# Altium schematic sheet Leaf_Adapter.SchDoc
size A4
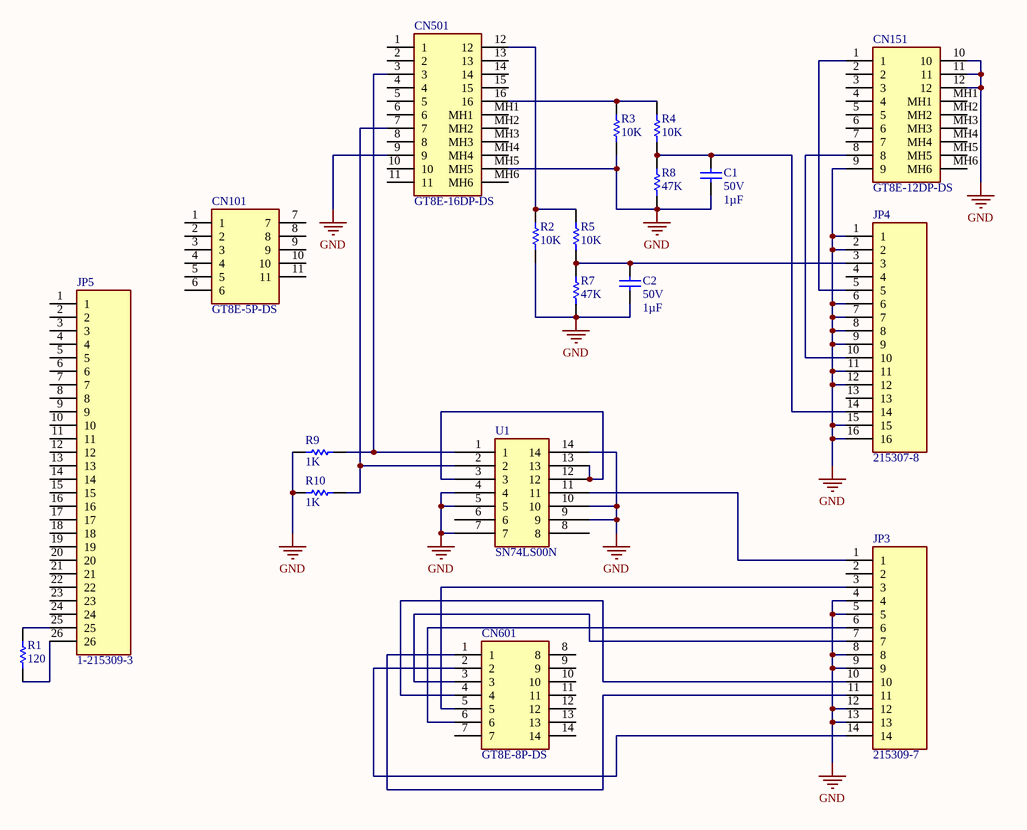
[diagram p0: Leaf_Adapter.SchDoc]

## Parts
C1  Voltage - Rated: 50V  Capacitance: 1µF  [KEMT-C330C105M5U5TA]  (hidden comment: C330C105M5U5TA)
C2  Voltage - Rated: 50V  Capacitance: 1µF  [KEMT-C330C105M5U5TA]  (hidden comment: C330C105M5U5TA)
CN101  GT8E-5P-DS  [GT8E5PDS]
CN151  GT8E-12DP-DS  [GT8E12DPDS]
CN501  GT8E-16DP-DS  [GT8E16DPDS]
CN601  GT8E-8P-DS  [GT8E8PDS]
JP3  215309-7  [TE_215309-7]
JP4  215307-8  [TE_215307-8]
JP5  1-215309-3  [TE_1-215309-3]
R1  Resistance: 120  [RESA60-630X240]  (hidden comment: MRS25000C1200FC100)
R2  Resistance: 10K  [RESA60-630X240]  (hidden comment: MFR-25FBF5210K)
R3  Resistance: 10K  [RESA60-630X240]  (hidden comment: MFR-25FBF5210K)
R4  Resistance: 10K  [RESA60-630X240]  (hidden comment: MFR-25FBF5210K)
R5  Resistance: 10K  [RESA60-630X240]  (hidden comment: MFR-25FBF5210K)
R7  Resistance: 47K  [RESA60-630X240]  (hidden comment: MRS25000C4702FC100)
R8  Resistance: 47K  [RESA60-630X240]  (hidden comment: MRS25000C4702FC100)
R9  Resistance: 1K  [RESA60-630X240]  (hidden comment: MFR-25FBF52-1K)
R10  Resistance: 1K  [RESA60-630X240]  (hidden comment: MFR-25FBF52-1K)
U1  SN74LS00N  [N0014A]

## Nets
GND: C1.1 C2.1 CN151.9 CN151.10 CN151.11 CN151.12 CN501.9 CN501.MH5 JP3.4 JP3.5 JP3.8 JP3.9 JP3.12 JP3.13 JP4.1 JP4.2 JP4.6 JP4.7 JP4.8 JP4.9 JP4.11 JP4.12 JP4.15 JP4.16 R2.1 R3.1 R7.1 R8.1 R9.1 R10.1 U1.4 U1.5 U1.7 U1.9 U1.10 U1.14
NetC1_2: C1.2 JP4.14 R4.1 R8.2
NetC2_2: C2.2 JP4.3 R5.2 R7.2
NetCN151_1: CN151.1 JP4.5
NetCN151_8: CN151.8 JP4.10
NetCN501_3: CN501.3 R9.2 U1.1
NetCN501_7: CN501.7 R10.2 U1.2
NetCN501_12: CN501.12 R2.2 R5.1
NetCN501_16: CN501.16 R3.2 R4.2
NetCN601_1: CN601.1 JP3.11
NetCN601_2: CN601.2 JP3.14
NetCN601_3: CN601.3 JP3.7
NetCN601_4: CN601.4 JP3.10
NetCN601_5: CN601.5 JP3.3
NetCN601_6: CN601.6 JP3.6
NetJP3_1: JP3.1 U1.11
NetJP5_25: JP5.25 R1.2
NetJP5_26: JP5.26 R1.1
NetU1_3: U1.3 U1.12 U1.13

Not connected (* = marked no-connect by the designer): CN101 1 2 3 4 5 6 7 8 9 10 11; CN151 2 3 4 5 6 7 MH1 MH2 MH3 MH4 MH5 MH6; CN501 1 2 4 5 6 8 10 11 13 14 15 MH1 MH2 MH3 MH4 MH6; CN601 7 8 9 10 11 12 13 14; JP3 2; JP4 4 13; JP5 1 2 3 4 5 6 7 8 9 10 11 12 13 14 15 16 17 18 19 20 21 22 23 24; U1 6 8

## Library data of the parts
C1 C2 = CMP-2000-06056-1: Ceramic Capacitor, 1 uF, +/- 20%, 50 V, -10 to 85 degC, 2-Pin THD, RoHS, Bulk; Manufacturer: Kemet; Temperature Coefficient: Z5U; Catalog Drawings: C330(std); Product Training Modules: CapacitorBasics-TypicalUsesforCapacitors; Online Catalog: GoldenMax™Series; Other Names: 399-4390; PCN Design/Specification: C3yySeriesGoldenMaxLeadConfiguration02/Feb/2015; Thickness (Max): -; Size / Dimension: 0.300"Lx0.150"W(7.62mmx3.81mm); Mounting Technology: ThroughHole; Tolerance: ±20%; Mounting Type: ThroughHole; Datasheet URL: http://www.kemet.com/Lists/ProductCatalog/Attachments/599/KEM_C1051_GOLDMAX_Z5U.pdf; Series: GoldenMax™; Standard Package: 250; Ratings: -; Applications: GeneralPurpose; Package Reference: C330C105M5U5TA; Packaging: Bulk; Category: Capacitors; Package Description: 2-Pin Through Hole Device, Body 7.11 x 4.07 mm; Operating Temperature: 10°C~85°C; Height - Seated (Max): 0.360"(9.14mm); Manufacturer URL: http://www.kemet.com/; Lead Spacing: 0.200"(5.08mm); Features: -; Lead Style: Straight; Package / Case: Radial; Family: CeramicCapacitors; Datasheet Version: 12/2015
CN101 = GT8E-5P-DS: Connector; Manufacturer_Name: Hirose; Datasheet Link: https://www.hirose.com/product/en/download_file/key_name/GT8E/category/Catalog/doc_file_id/49379/&file_category_id=4&item_id=35&is_series=1; Height: 7mm; Manufacturer_Part_Number: GT8E-5P-DS
CN151 = GT8E-12DP-DS: Connector; Manufacturer_Name: Hirose; Datasheet Link: https://www.hirose.com/product/document?clcode=&productname=&series=GT8E&documenttype=Catalog&lang=en&documentid=D49379_en; Height: 10.5mm; Manufacturer_Part_Number: GT8E-12DP-DS
CN501 = GT8E-16DP-DS: Connector; Manufacturer_Name: Hirose; Manufacturer_Part_Number: GT8E-12DP-DS; Datasheet Link: https://www.hirose.com/product/document?clcode=&productname=&series=GT8E&documenttype=Catalog&lang=en&documentid=D49379_en; Height: 10.5mm
CN601 = GT8E-8P-DS: Connector; Manufacturer_Name: Hirose; Datasheet Link: https://www.mouser.co.uk/datasheet/2/185/GT8E_catalog-939506.pdf; Height: 7mm; Manufacturer_Part_Number: GT8E-8P-DS
JP3 = 215309-7: 2X7P HV100 REC CON. TE, 8.5MM; Number_of_Positions: 7; Centerline_Pitch: 2.54 mm[.1 in]; Product_Type: Connector; MF: TE Connectivity; Price: None; SnapEDA_Link: https://www.snapeda.com/parts/215309-7/TE%20Connectivity%20AMP%20Connectors/view-part/1233007/?ref=snap; MP: 215309-7; EU_RoHS_Compliance: Compliant; Availability: Unavailable; Value: *; TE_purchase_URL: https://www.te.com/usa-en/product-215309-7.html?te_bu=Cor&te_type=disp&te_campaign=seda_glo_cor-seda-global-disp-prtnr-fy19-seda-model-bom-cta_sma-317_1&elqCampaignId=32493; Package: None
R1 = MRS25000C1200FC100: RES 120 OHM 1% 0.6W AXIAL; Manufacturer: Vishay Beyschlag/Draloric/BC Components; Temperature Coefficient: ±50ppm/°C; Datasheet URL: https://www.vishay.com/docs/28724/mrs16m25.pdf; Mount: ThroughHole; Termination: Axial; Composition: MetalFilm; Number of Terminations: 2; Mounting Technology: ThroughHole; Max Operating Temperature: 155degC; Min Operating Temperature: -55degC; Tolerance: 1%; Power Rating: 0.6W; Package: Axial; Supplier 1: Digi-Key; Supplier Part Number 1: BC4562CT-ND
R2-R5 = CMP-1659-00074-2: Axial Resistor, 10 KOhm, +/- 1%, 0.25 W, -55 to 155 degC, 2-Pin THD, RoHS, Bulk; Manufacturer: Yageo; Temperature Coefficient: 100ppm\/degreesC; Voltage Rating: 250V; Voltage Rating (DC): 200V; Max Power Dissipation: 250mW; Datasheet URL: http://www.yageo.com/documents/recent/Yageo%20LR_MFR_2013.pdf; Packaging: Bulk; RoHSCompliant: True; Mount: ThroughHole; Package Reference: MFR-25; Termination: Axial; Composition: MetalFilm; Number of Terminations: 2; Package Quantity: 200; Mounting Technology: ThroughHole; Length: 0.248inch; Max Operating Temperature: 155degC; Min Operating Temperature: -55degC; Datasheet Version: 04/2013; Lead Free: LeadFree; Manufacturer URL: http://www.yageo.com/; Tolerance: 1%; Power Rating: 250mW; Package Description: 2-Pin Axial Lead, Dia 2.4 mm, Body Length 6.3 mm; Military Standard: Not; Case\/Package: Axial
R7 R8 = MRS25000C4702FC100: RES 47K OHM 0.6W 1% AXIAL; Manufacturer: Vishay Beyschlag/Draloric/BC Components; Temperature Coefficient: ±50ppm/°C; Datasheet URL: https://www.vishay.com/docs/28724/mrs16m25.pdf; Mount: ThroughHole; Termination: Axial; Composition: MetalFilm; Number of Terminations: 2; Mounting Technology: ThroughHole; Max Operating Temperature: 155degC; Min Operating Temperature: -55degC; Tolerance: 1%; Power Rating: 0.6W; Package: Axial; Supplier 1: Digi-Key; Supplier Part Number 1: BC4177CT-ND
R9 R10 = CMP-1659-00075-1: Axial Resistor, 1 KOhm, +/- 1%, 250 mW, -55 to 155 degC, 2-Pin THD, RoHS, Bulk; Voltage Rating: 250 V; Power Rating: 250 mW; ComponentLink2Description: Datasheet; RoHSCompliant: true; PackageReference: MFR-25; Case\Package: Axial; Max Operating Temperature: 155 degC; DatasheetVersion: Apr-13; Tolerance: 1%; ComponentLink1URL: http://www.yageo.com/; Length: 0.248 inch; ComponentLink2URL: http://www.yageo.com/documents/recent/Yageo%20LR_MFR_2013.pdf; Packaging: Bulk; Package Quantity: 200; PackageDescription: 2-Pin Axial Lead, Dia 2.4 mm, Body Length 6.3 mm; Min Operating Temperature: -55 degC; ComponentLink1Description: Manufacturer URL
U1 = SN74LS00N: IC GATE NAND 4CH 2-INP 14DIP; Manufacturer: Texas Instruments; Logic Type: NAND Gate; Number of Inputs: 2; Voltage - SupplyParameter 1: 4.75V ~ 5.25V; Current - Output High, Low: 400µA, 8mA; Logic Level - Low: 0.8V; Logic Level - High: 2V; Max Propagation Delay @ V, Max CL: 15ns @ 5V, 15pF; Operating Temperature: 0°C ~ 70°C (TA); Mounting Type: Through Hole; Supplier 1: Digi-Key; Supplier Part Number 1: 296-1626-ND
JP4 = 215307-8: Package: None; Price: None; Value: *; MP: 215307-8; Availability: Unavailable
JP5 = 1-215309-3: Package: None; Price: None; Value: *; MP: 1-215309-3; Availability: Unavailable